# EAGLE design main (EAGLE 7.5.0)
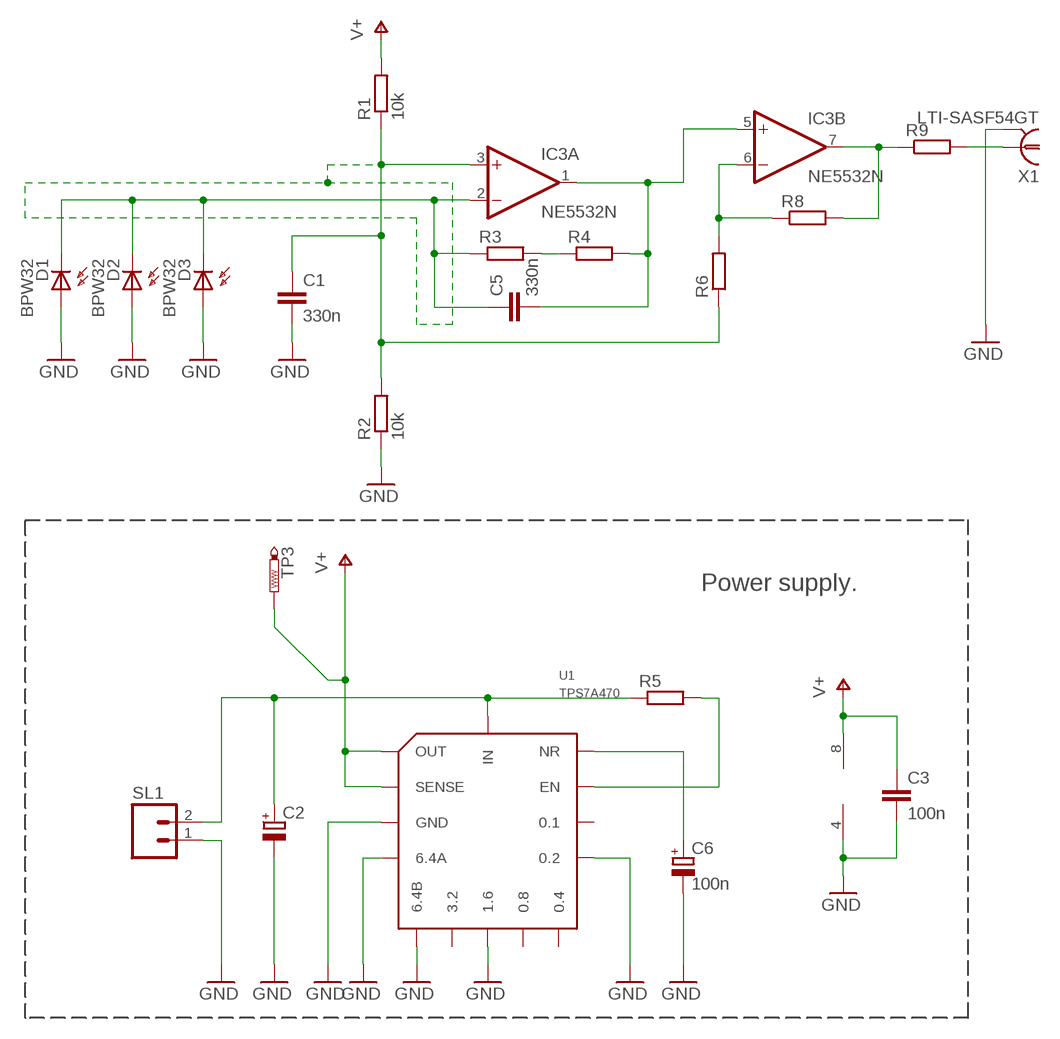
[diagram p0: schematic, sheet 1]

## Parts
C1  330n  C-EUC0805  [C0805]
C2  CPOL-EUT/3528-12R  [T/3528-12R]
C3  100n  C-EUC0805  [C0805]
C5  330n  C-EUC1206  [C1206]
C6  100n  CPOL-EUA/3216-18W  [A/3216-18W]
D1  BPW32  [BPW32]
D2  BPW32  [BPW32]
D3  BPW32  [BPW32]
IC3  NE5532N  [DIL08]
R1  10k  R-EU_R0805  [R0805]
R2  10k  R-EU_R0805  [R0805]
R3  R-EU_MELF0204W  [MINI_MELF-0204W]
R4  R-EU_MELF0204W  [MINI_MELF-0204W]
R5  R-EU_M1206  [M1206]
R6  R-EU_R0805  [R0805]
R8  R-EU_M0805  [M0805]
R9  R-EU_0204/2V  [0204V]
SL1  M02  [02P]
TP3  PTR1TP12R  [TP12R]
U1  TPS7A470  [S-PVQFN-N20]
X1  LTI-SASF54GT  [LTI-SASF54GT]

## Nets
GND: C1.2 C2.- C3.2 C6.- D1.A D2.A D3.A IC3.4(P:V-) R2.1 SL1.1 U1.2(GND) U1.4(6.4A) U1.5(6.4B) U1.7(GND) U1.8(1.6) U1.11(0.2) U1.17(GND) U1.18(GND) U1.19(GND) U1.EXP(GND) X1.2 X1.3 X1.4 X1.5
N$1 [sensor_input]: C5.2 IC3.1(A:OUT) IC3.5(B:+IN) R4.2
N$2: IC3.6(B:-IN) R6.2 R8.1
N$3 [sensor_input]: R3.2 R4.1
N$4 [sensor_input]: C5.1 D1.K(C) D2.K(C) D3.K(C) IC3.2(A:-IN) R3.1
N$5: C6.+ U1.14(NR)
N$6: R5.2 U1.13(EN)
N$7: C1.1 IC3.3(A:+IN) R1.1 R2.2 R6.1
N$8: C2.+ R5.1 SL1.2 U1.15(IN) U1.16(IN)
N$9: IC3.7(B:OUT) R8.2 R9.1
N$15: R9.2 X1.1
V+: C3.1 IC3.8(P:V+) R1.2 TP3.TP U1.1(OUT) U1.3(SENSE) U1.20(OUT)
Unconnected: U1.6(3.2) U1.9(0.8) U1.10(0.4) U1.12(0.1)

## Notes on the sheet
- Power supply.

## Library data of the parts
C1 C3 = rcl:C-EU: CAPACITOR, European symbol
C2 = resistor:CPOL-EU: POLARIZED CAPACITOR, European symbol
C5 = resistor:C-EU: CAPACITOR, European symbol
C6 = rcl:CPOL-EU: POLARIZED CAPACITOR, European symbol
D1-D3 = opto-trans-siemens:BPW32: PHOTO DIODE; OC_FARNELL: unknown; OC_NEWARK: unknown
IC3 = linear:NE5532: AUDIO AMPLIFIER
R1 R2 = rcl:R-EU_: RESISTOR, European symbol
R3-R6 R8 R9 = resistor:R-EU_: RESISTOR, European symbol
SL1 = con-amp-quick:M02: AMP QUICK CONNECTOR; OC_FARNELL: unknown; OC_NEWARK: unknown
TP3 = testpad:PTR1: TEST PIN
U1 = regulator-jqi:TPS7A470: Ultra-low noise LDO regulator, variable programmable output, 36V
X1 = con-coax:LTI-SASF54GT: SMA vertical PCB thrue hole jack Source: Lighthorse Technologies, inc. SASF54GT.pdf; OC_FARNELL: unknown; OC_NEWARK: unknown

## Net classes
0 signal: width 0.254 mm, drill 0.254 mm, clearance 0.254 mm
1 sensor_input: width 0.254 mm, clearance 0.762 mm
2 power_supply: width 0.559 mm

## Board
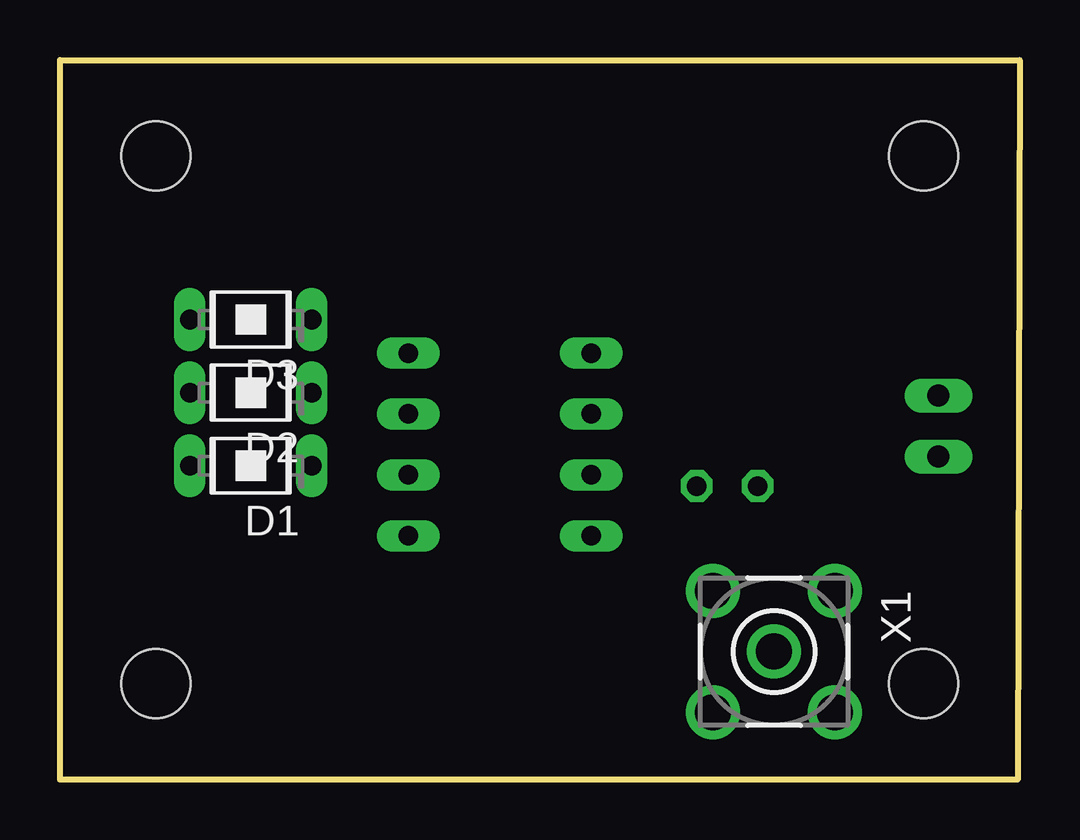
[diagram p1: board, top side]
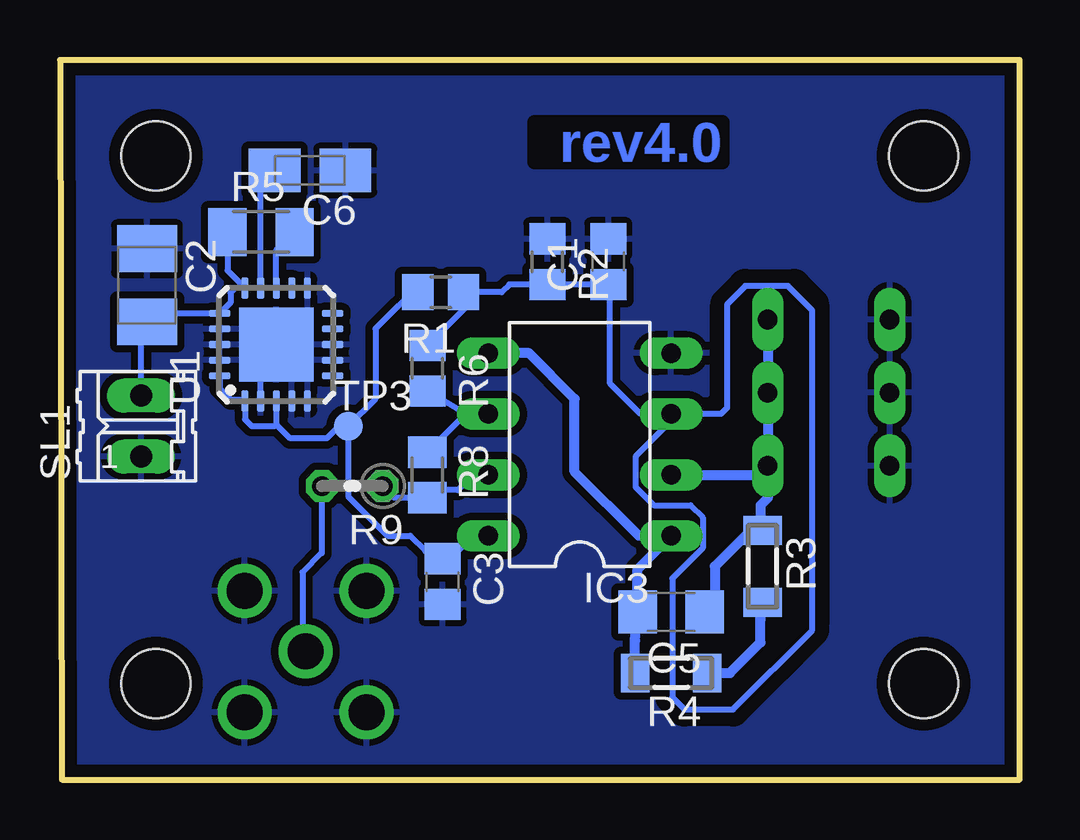
[diagram p2: board, bottom side, seen from below]

Size 40 x 30 mm. Coordinates in mm from the lower left corner, seen from the top.
Outline: 0,30 40,30 39.92,0 0,0 0,30
Copper layers (1*16): Top 0.035mm / dielectric 1.5mm / Bottom 0.035mm
Design rules "default *": minimum track width 9mil, minimum drill 24mil, track to track 12mil, track to pad 12mil, pad to pad 10mil, via to via 10mil, smd to smd 10mil, copper to edge 20mil, drill to drill 9mil, minimum pad ring 10mil, minimum via ring 8mil, stop-mask expansion 9mil, vias tented up to drill 0mil, thermal gap 10mil
Holes 2.9 mm at 4,26 36,26 36,4 4,4
bRestrict: 10 lines

### Footprints (pad centres in the part's own frame; a part is rotated, then mirrored left to right if it is on the bottom)
C0805 = smd 1.3 x 1.5: 1 -0.95,0; 2 0.95,0
T/3528-12R = smd 1.95 x 2.5: + 1.525,0; - -1.525,0
C1206 = smd 1.6 x 1.8: 1 -1.4,0; 2 1.4,0
A/3216-18W = smd 2.15 x 1.8: + 1.475,0; - -1.475,0
BPW32 = drill 0.813 long: A 0,2.54; K 0,-2.54
DIL08 = drill 0.813 pad 1.27 long: 1 -3.81,-3.81; 2 -1.27,-3.81; 3 1.27,-3.81; 4 3.81,-3.81; 5 3.81,3.81; 6 1.27,3.81; 7 -1.27,3.81; 8 -3.81,3.81
R0805 = smd 1.3 x 1.5: 1 -0.95,0; 2 0.95,0
MINI_MELF-0204W = smd 1.2 x 1.6: 1 -1.5,0; 2 1.5,0
M1206 = smd 1.6 x 2: 1 -1.4,0; 2 1.4,0
M0805 = smd 1.3 x 1.6: 1 -0.95,0; 2 0.95,0
0204V = drill 0.813 octagon: 1 -1.27,0; 2 1.27,0
02P = drill 0.914 long: 1 -1.27,0; 2 1.27,0
TP12R = smd 1.2 x 1.2: TP 0,0
S-PVQFN-N20 = smd 0.9 x 0.3: 1 -2.35,1.3; 2 -2.35,0.65; 3 -2.35,0; 4 -2.35,-0.65; 5 -2.35,-1.3; 11 2.35,-1.3; 12 2.35,-0.65; 13 2.35,0; 14 2.35,0.65; 15 2.35,1.3 | smd 0.3 x 0.9: 6 -1.3,-2.35; 7 -0.65,-2.35; 8 0,-2.35; 9 0.65,-2.35; 10 1.3,-2.35; 16 1.3,2.35; 17 0.65,2.35; 18 0,2.35; 19 -0.65,2.35; 20 -1.3,2.35 | smd 3.1 x 3.1: EXP 0,0
LTI-SASF54GT = drill 1.5 pad 2.2: 1 0,0; 2 -2.54,2.54; 3 2.54,2.54; 4 2.54,-2.54; 5 -2.54,-2.54

### Placement (x,y rotation side)
C1  17.14,21.59 90 bottom
C2  36.37,20.61 270 bottom
C3  24.05,8.26 270 bottom
C5  14.53,6.99 180 bottom
C6  29.58,25.39 180 bottom
D1  7.95,13.08 90 top
D2  7.95,16.13 90 top
D3  7.95,19.18 90 top
IC3  18.34,13.97 90 bottom
R1  24.13,20.32 180 bottom
R2  19.68,21.59 270 bottom
R3  10.71,8.89 270 bottom
R4  14.53,4.45 180 bottom
R5  31.62,22.83 0 bottom
R6  24.68,17.14 270 bottom
R8  24.68,12.7 270 bottom
R9  27.82,12.24 180 bottom
SL1  36.62,14.73 90 bottom
TP3  27.99,14.73 0 bottom
U1  30.98,18.13 90 bottom
X1  29.77,5.33 270 top

### Tracks (layer width: path | path; a pad name or v marks a point on that pad's centre or on a via)
GND
  Bottom 0.254: U1.2 31.64,17.48 U1.EXP
  pour Bottom: 0,30 0,0 39.92,0 40,30
N$1
  Bottom 0.406: R4.2 16.02,5.8 C5.2 15.93,8.76 IC3.1 15.88,10.16 18.54,12.83 18.54,15.88 20.45,17.78 IC3.5
N$2
  Bottom 0.254: IC3.6 23.09,15.24 | 23.09,15.24 R6.2 | R8.1 23.09,15.24
N$3
  Bottom 0.406: R4.1 12.06,4.45 10.79,5.71 10.79,6.67 R3.2
N$4
  Bottom 0.406: D3.K D2.K D1.K | D1.K 10.49,11.73 10.79,11.43 10.79,10.47 R3.1 11.2,10.39 12.7,8.89 12.7,7.22 C5.1 | IC3.2 10.87,12.7 D1.K
N$5
  Bottom 0.254: U1.14 31.64,24.81 C6.+
N$6
  Bottom 0.254: U1.13 30.98,22.07 R5.2
N$7
  Bottom 0.254: 14.73,15.24 IC3.3 12.45,15.24 12.19,15.49 12.19,19.81 11.43,20.57 9.65,20.57 8.64,19.56 8.64,6.22 11.94,2.92 13.97,2.92 14.48,3.43 14.48,8.38 13.21,9.65 13.21,10.92 13.72,11.43 15.24,11.43 16,12.19 16,13.46 14.73,14.73 14.73,15.24 | 14.73,15.24 15.79,15.24 17.07,16.51 17.07,20.77 C1.1 R2.2 21.27,20.64 21.59,20.32 R1.1 | 22.91,20.89 R1.1 | R1.1 22.97,19.81 R6.1
N$8
  Bottom 0.254: R5.1 33.02,21.22 U1.15 32.7,20.48 32.89,20.29 32.89,19.88 U1.16 35.71,19.43 C2.+ 36.62,19.84 SL1.2
N$9
  Bottom 0.254: IC3.7 22.78,12.7 23.41,12.06 24.37,12.06 R8.2 26.06,11.75 R9.1
N$15
  Bottom 0.254: R9.2 29.09,9.44 29.89,8.64 29.89,5.46 X1.1
V+
  Bottom 0.254: U1.20 33.34,16.29 32.89,15.85 32.35,15.85 U1.1 32.28,15.01 32,14.73 31.06,14.73 30.98,14.81 | IC3.8 22.78,10.16 23.41,9.53 23.73,9.53 C3.1 24.37,9.53 24.77,9.53 25.4,10.16 26.34,10.16 27.99,11.81 TP3.TP | 24.68,20.95 R1.2 24.87,20.77 26.84,18.8 26.84,15.88 TP3.TP | U1.3 30.98,14.81 | 30.98,14.81 30.4,14.22 28.88,14.22 28.37,14.73 TP3.TP

### Text on the board
Bottom: rev4.0